# Altium schematic sheet USBC.SchDoc: USBC/Power
size A; DrawnBy: Sindre Hovland; Organization: Open sauce; Revision: V0; SheetNumber: 3; SheetTotal: 5
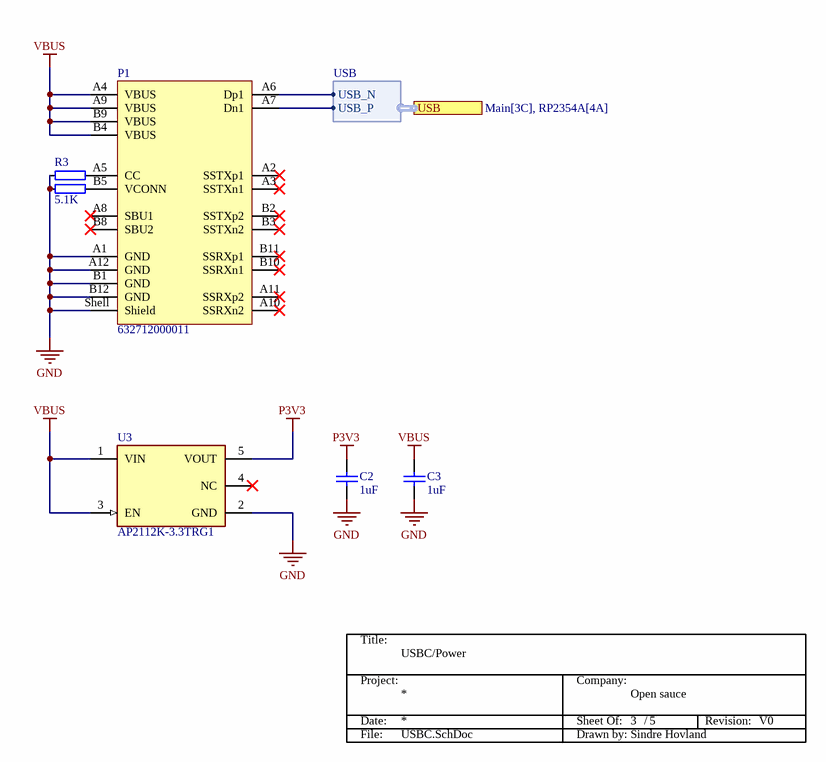
[diagram p0: USBC.SchDoc]

## Parts
*?  TitleBlock  (value not drawn)  (graphical)
C2  1uF  [C0402]
C3  1uF  [C0402]
P1  632712000011  [632712000011]
R3  5.1K  [R0201]  (value not drawn)
R7  5.1K  [R0201]
U3  AP2112K-3.3TRG1  [FP-SOT25-IPC_C]

## Ports
USB (harness USB, see Main[3C], RP2354A[4A])

## Harnesses
USB: USB_N, USB_P

## Nets
GND: C2.1 C3.1 P1.A1(GND) P1.A12(GND) P1.B1(GND) P1.B12(GND) P1.Shell(Shield) R3.2 R7.2 U3.2(GND)
P3V3: C2.2 U3.5(VOUT)
VBUS: C3.2 P1.A4(VBUS) P1.A9(VBUS) P1.B4(VBUS) P1.B9(VBUS) U3.1(VIN) U3.3(EN)
NetP1_A5: P1.A5(CC) R3.1
NetP1_A6: P1.A6(Dp1) ; port USB.USB_N
NetP1_A7: P1.A7(Dn1) ; port USB.USB_P
NetP1_B5: P1.B5(VCONN) R7.1

Not connected (* = marked no-connect by the designer): P1 A2(SSTXp1)* A3(SSTXn1)* A8(SBU1)* A10(SSRXn2)* A11(SSRXp2)* B2(SSTXp2)* B3(SSTXn2)* B8(SBU2)* B10(SSRXn1)* B11(SSRXp1)*; U3 4(NC)*

## Notes on the sheet
- (in symbol TitleBlock) Title:; Project:; Company:; Date:; Sheet Of:; /; Revision:; File:; Drawn by:

## Library data of the parts
C2 C3 = CAP: Capacitor; Value: 100pF; Published: 8-Jun-2000; Revision: July-2002: Re-released for DXP Platform.; Publisher: Altium Limited
P1 = CMP-1502-03215-3: NexarPartId: 68112673; Voltage Rating: 20V; Connector Type: USB; Contact Resistance: 30mΩ; USB Standard: USB 3.1; Number of Contacts: 22; Insulation Resistance: 1GΩ; Current Rating: 5A; Number of Pins: 22; Orientation: Horizontal; Height: 1.9mm; RoHS: Compliant; Contact Material: Gold, Nickel; Min Operating Temperature: -25°C; Packaging: Tape and Reel; Mount: Horizontal, Surface Mount; Max Operating Temperature: 105°C
R3 R7 = RES: Resistor, Generic; Part Number: R0201-0R; Part number IPS: 00000003245; Value: 0R; Note: Chip Res 5%; Artikkelnr Noca: N.A.; Manufacturer: *; Manufacturer Part Number: *; ComponentLink1URL: *; ComponentLink1Description: Datasheet; ComponentLink2URL: *; ComponentLink2Description: Supplier link; HelpURL: *; Footprint Doc: 0201; LatestRevisionDate: 2017-11-09; Pin Count: 2; Publisher: Nordic Semiconductor; Published: 2014-11-13; Supplier 1: *; Supplier Part Number 1: *; Supplier 2: *; Supplier Part Number 2: *
U3 = CMP-12756-000035-1: IC REG LINEAR 3.3V 600MA SOT25; Number of Regulators: 1; Output Type: Fixed; Polarity: Positive; Min Input Voltage: 2.5V; Max Input Voltage: 6V; Accuracy: 1.5%; Quiescent Current: 55uA; Dropout Voltage: 250mV; Min Operating Temperature: -40°C; Length: 3.1mm; Output Current: 600mA; Max Operating Temperature: 85°C; Package Quantity: 1; Output Voltage: 3.3V; Width: 1.7mm; Number of Outputs: 1; Packaging: Tape and Reel; Height: 1.3mm; Lead Free: Lead Free; Max Output Current: 600mA; Case/Package: SOT-23-5; Mount: Surface Mount; Number of Pins: 5